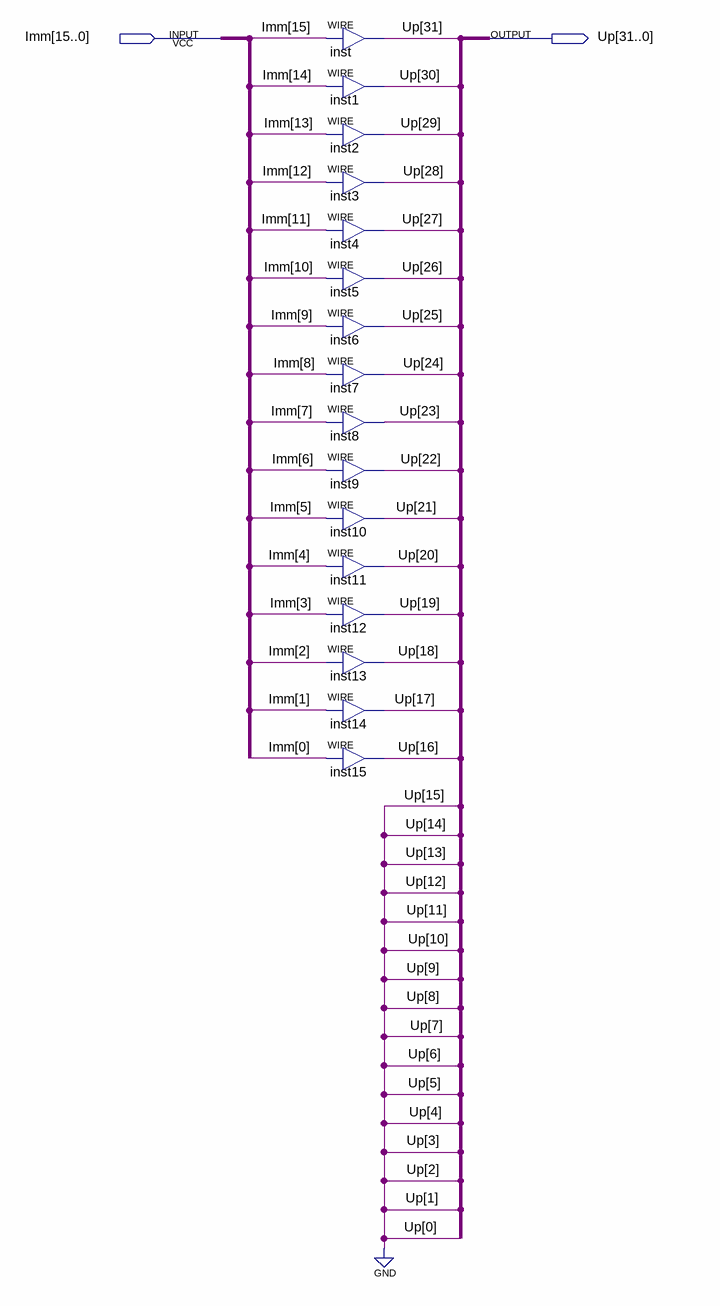
[diagram p0: schematic sheet]
// Quartus schematic Upper.bdf as structural Verilog: 16 symbols, 2 pins
module Upper (
  input  [15:0] Imm,
  output [31:0] Up
);

  assign Up[31] = Imm[15];  // WIRE inst
  assign Up[30] = Imm[14];  // WIRE inst1
  assign Up[29] = Imm[13];  // WIRE inst2
  assign Up[28] = Imm[12];  // WIRE inst3
  assign Up[27] = Imm[11];  // WIRE inst4
  assign Up[26] = Imm[10];  // WIRE inst5
  assign Up[25] = Imm[9];  // WIRE inst6
  assign Up[24] = Imm[8];  // WIRE inst7
  assign Up[23] = Imm[7];  // WIRE inst8
  assign Up[22] = Imm[6];  // WIRE inst9
  assign Up[21] = Imm[5];  // WIRE inst10
  assign Up[20] = Imm[4];  // WIRE inst11
  assign Up[19] = Imm[3];  // WIRE inst12
  assign Up[18] = Imm[2];  // WIRE inst13
  assign Up[17] = Imm[1];  // WIRE inst14
  assign Up[16] = Imm[0];  // WIRE inst15

  assign Up[15:0] = {16{1'b0}};
endmodule
